# EAGLE design PiGI-V1.1 (EAGLE 6.2)
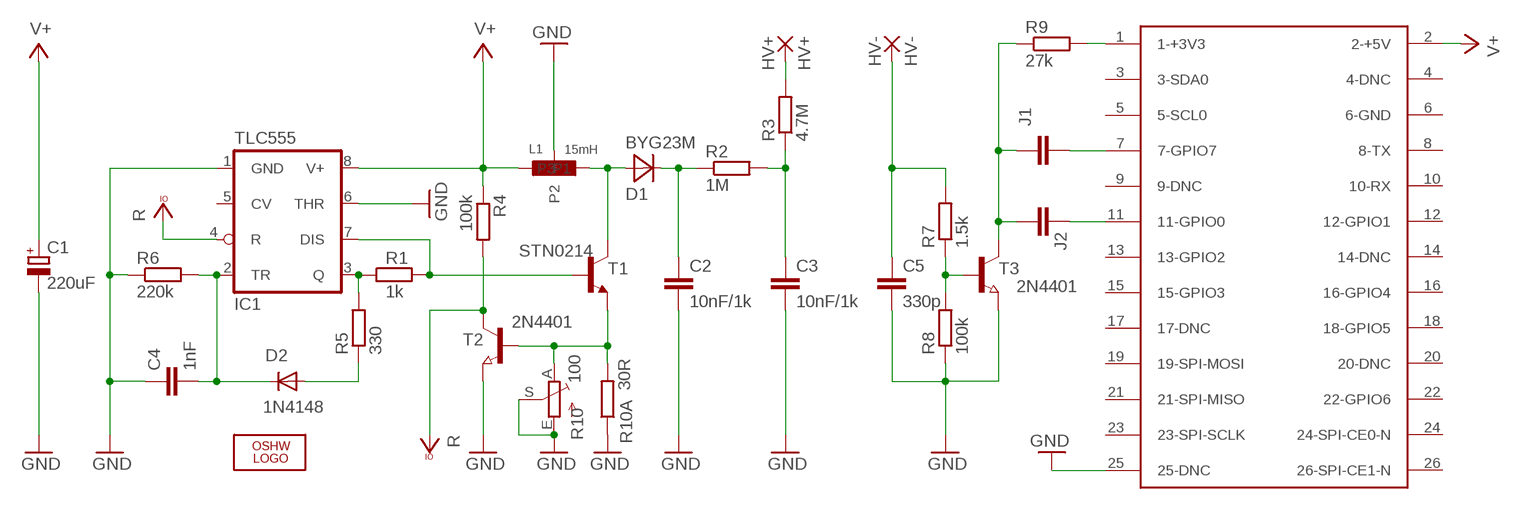
[diagram p0: schematic, sheet 1]

## Parts
C1  220uF  CPOL-EU153CLV-0810  [153CLV-0810]
C2  10nF/1k  C-EUC1206  [C1206]
C3  10nF/1k  C-EUC1206  [C1206]
C4  1nF  C-EUC0805  [C0805]
C5  330p  C-EUC0805  [C0805]
D1  BYG23M  MBRA340T3  [SMA]
D2  1N4148  CGRM4001-G  [SOD-123_MINI-SMA]
HV+  HV+  SMD5  [SMD2,54-5,08]
HV-  HV-  SMD5  [SMD2,54-5,08]
IC1  TLC555  NE555D  [SO08]
J1  C-EUC0805  [C0805]
J2  C-EUC0805  [C0805]
L1  15mH  1200LRS  [1200LRS]
LOGO1  OSHW_LOGO_FILLX0150-NT  [OSHW_FILLX150_NOTEXT]
PI-GIV1.0  RASPBERRY-PI  [RASPBERRY-PI]
R1  1k  R-EU_M0805  [M0805]
R2  1M  R-EU_R1206  [R1206]
R3  4.7M  R-EU_R1206  [R1206]
R4  100k  R-EU_R0805  [R0805]
R5  330  R-EU_R0805  [R0805]
R6  220k  R-EU_R0805  [R0805]
R7  1.5k  R-EU_R0805  [R0805]
R8  100k  R-EU_R0805  [R0805]
R9  27k  R-EU_R0805  [R0805]
R10  100  TRIM_EU-RJ9W  [RJ9W]
R10A  30R  R-EU_M0805  [M0805]
T1  STN0214  -NPN-SOT223  [SOT223]
T2  2N4401  NPN-TRANSISTOR_SOT23  [SOT23]
T3  2N4401  NPN-TRANSISTOR_SOT23  [SOT23]

## Nets
DIS: IC1.7(DIS) R1.2 T1.1(B)
GND: C1.- C2.2 C3.2 C4.1 C5.2 IC1.1(GND) IC1.6(THR) L1.P4(P2) PI-GIV1.0.25(25-DNC) R6.1 R8.1 R10.E(A) R10.S R10A.1 T2.2(E) T3.2(E)
N$1: IC1.3(Q) R1.1 R5.2
N$2: D2.A R5.1
N$3: C2.1 D1.C R2.1
N$4: PI-GIV1.0.1(1-+3V3) R9.2
N$5: C4.2 D2.C IC1.2(TR) R6.2
N$6: D1.A L1.P3 T1.4(C)
N$7: R10.A(E) R10A.2 T1.3(E) T2.1(B)
N$8: C3.1 R2.2 R3.1
N$9: R7.1 R8.2 T3.1(B)
N$10: J1.2 J2.2 R9.1 T3.3(C)
N$11: C5.1 HV-.1(P) R7.2
N$12: HV+.1(P) R3.2
N$13: J1.1 PI-GIV1.0.7(7-GPIO7)
N$14: J2.1 PI-GIV1.0.11(11-GPIO0)
V+: C1.+ IC1.8(V+) L1.P1 PI-GIV1.0.2(2-+5V) R4.1
VCCIO: IC1.4(R) R4.2 T2.3(C) ; supply symbol labelled R
Unconnected: IC1.5(CV) PI-GIV1.0.3(3-SDA0) PI-GIV1.0.4(4-DNC) PI-GIV1.0.5(5-SCL0) PI-GIV1.0.6(6-GND) PI-GIV1.0.8(8-TX) PI-GIV1.0.9(9-DNC) PI-GIV1.0.10(10-RX) PI-GIV1.0.12(12-GPIO1) PI-GIV1.0.13(13-GPIO2) PI-GIV1.0.14(14-DNC) PI-GIV1.0.15(15-GPIO3) PI-GIV1.0.16(16-GPIO4) PI-GIV1.0.17(17-DNC) PI-GIV1.0.18(18-GPIO5) PI-GIV1.0.19(19-SPI-MOSI) PI-GIV1.0.20(20-DNC) PI-GIV1.0.21(21-SPI-MISO) PI-GIV1.0.22(22-GPIO6) PI-GIV1.0.23(23-SPI-SCLK) PI-GIV1.0.24(24-SPI-CE0-N) PI-GIV1.0.26(26-SPI-CE1-N)

## Library data of the parts
C1 = rcl:CPOL-EU: POLARIZED CAPACITOR, European symbol
C2-C5 J1 J2 = rcl:C-EU: CAPACITOR, European symbol
D1 = diode:MBRA340T3: Surface Mount Schottky Power Rectifier Source: http://www.onsemi.com/pub_link/Collateral/MBRA340T3-D.PDF
D2 = diode:CGRM400*-G: Molded plasitc,JEDEC SOD-123/Mini SMA Source: Comchip CGRM4001-G.pdf
HV+ HV- = wirepad:SMD5: SMD PAD
IC1 = linear:*555: TIMER
L1 = murata-inductors:1200LRS
LOGO1 = ohw-logo:OSHW_LOGO_FILL
PI-GIV1.0 = RaspberryPi:RASPBERRY-PI: Raspberry Pi Board <http://www.raspberrypi.org/> Jacques Lagnel V1.0 (beta) 2012 Board dimension: Forum 3D model <http://www.raspberrypi.org/forum/general-discussion/mechanical-profile-3d-models?value=3d%20model&type=1&include=1&search=1&ret=all> The GPIO Connector (P1): http://elinux.org/RPi_Low-level_peripherals
R1-R9 R10A = resistor:R-EU_: RESISTOR, European symbol
R10 = pot:TRIM_EU-: POTENTIOMETER
T1 = transistor-neu-to92:*-NPN-: NPN Transistror
T2 T3 = semicon-smd-ipc:NPN-TRANSISTOR_: NPN TRANSISTOR

## Board
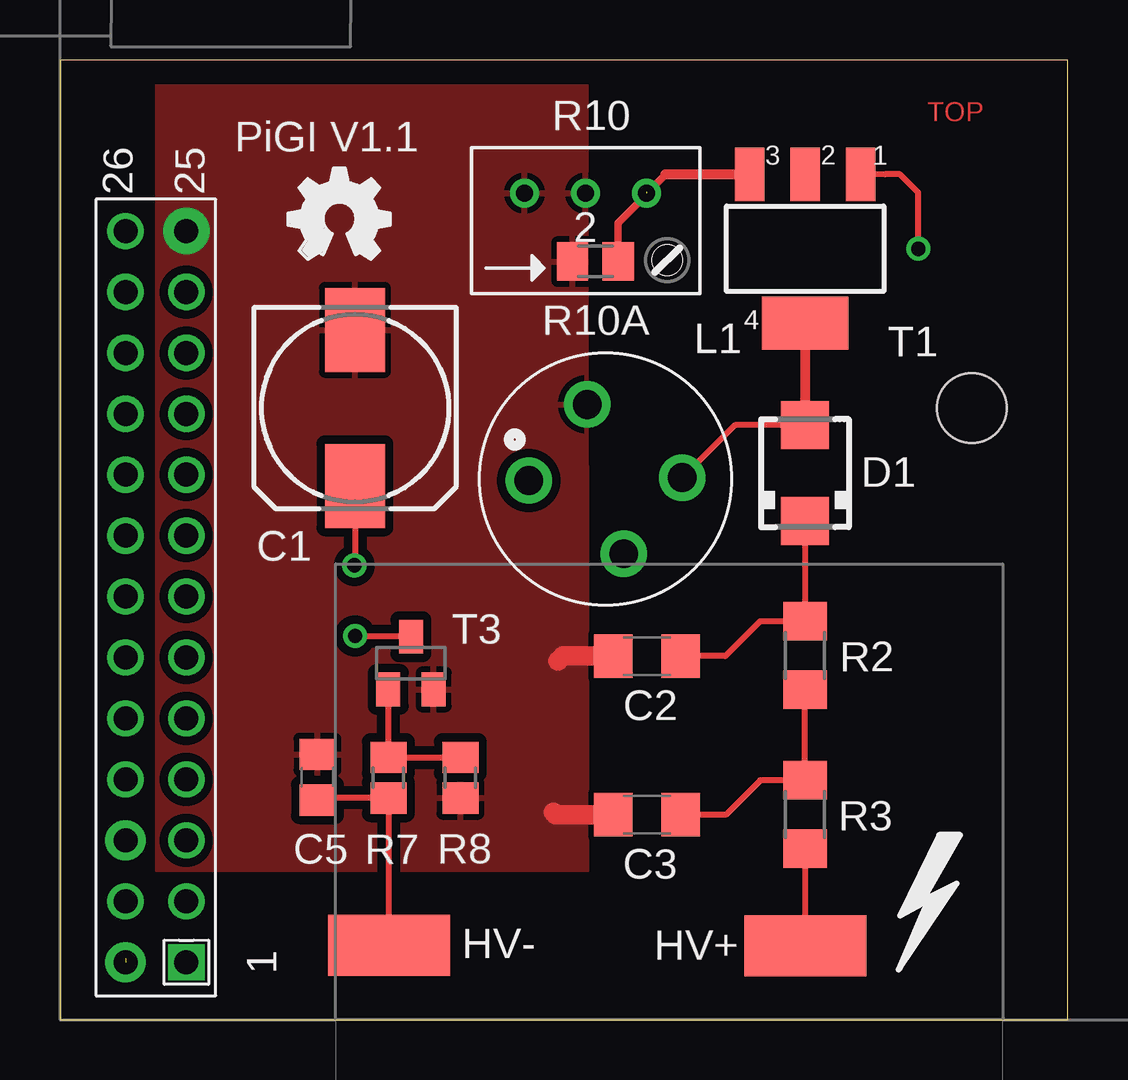
[diagram p1: board, top side]
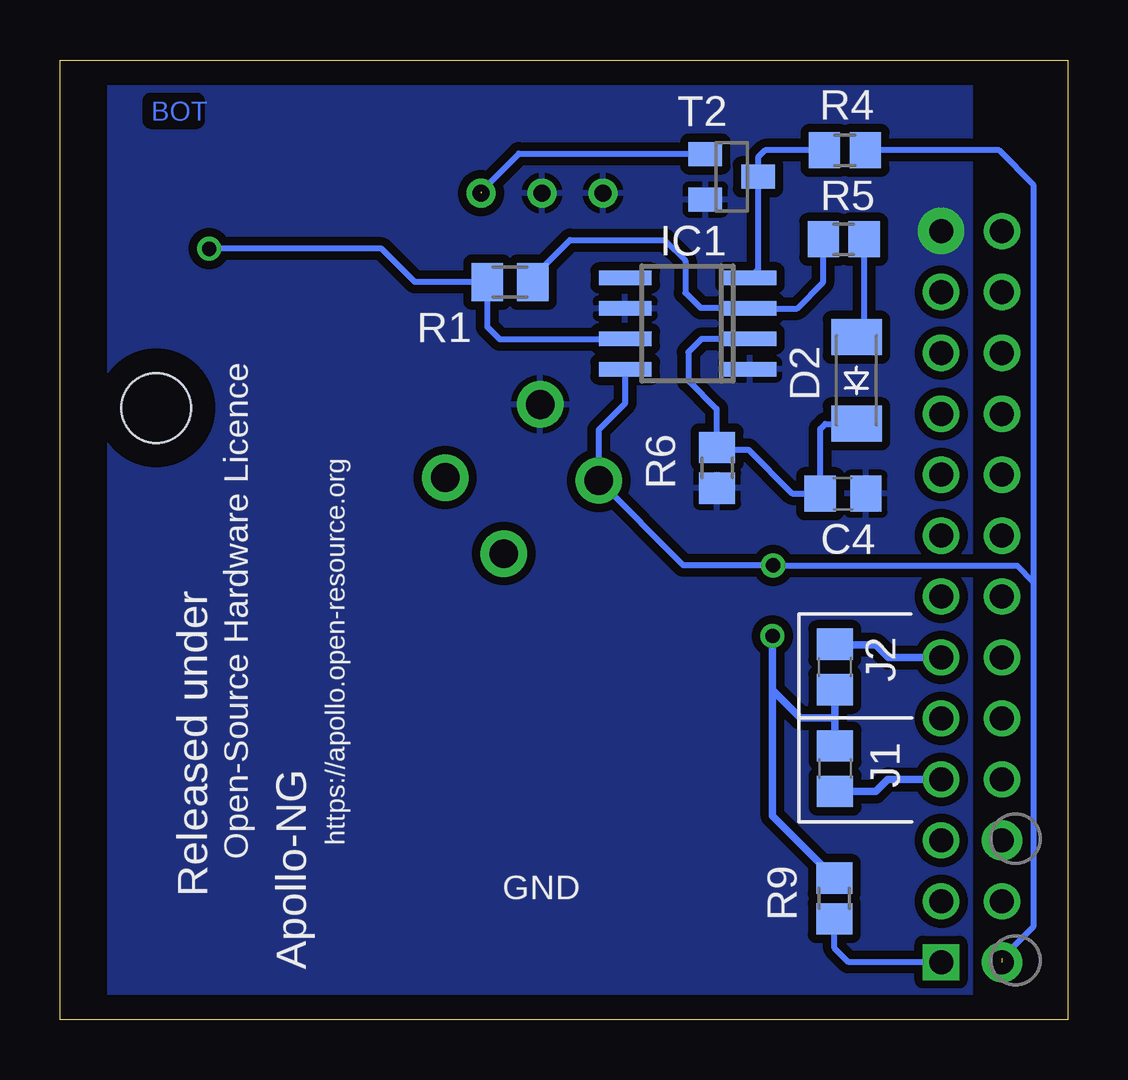
[diagram p2: board, bottom side, seen from below]

Size 42 x 40 mm. Coordinates in mm from the lower left corner, seen from the top.
Outline: 0,0 42,0 42,40 0,40 0,0
Copper layers (1*16): Top 0.035mm / dielectric 1.5mm / Bottom 0.035mm
Design rules: minimum track width 10mil, minimum drill 24mil, track to track 8mil, track to pad 8mil, pad to pad 8mil, via to via 8mil, smd to smd 8mil, copper to edge 40mil, drill to drill 8mil, minimum pad ring 10mil, minimum via ring 8mil, stop-mask expansion 4mil, vias tented up to drill 0mil, thermal gap 10mil
Holes 2.9 mm at 38,25.5

### Footprints (pad centres in the part's own frame; a part is rotated, then mirrored left to right if it is on the bottom)
153CLV-0810 = smd 3.5 x 2.5: + 3.25,0; - -3.25,0
C1206 = smd 1.6 x 1.8: 1 -1.4,0; 2 1.4,0
C0805 = smd 1.3 x 1.5: 1 -0.95,0; 2 0.95,0
SMA = smd 2 x 2: A 2,0; C -2,0
SOD-123_MINI-SMA = smd 1.5 x 2.1: A 1.8,0; C -1.8,0
SMD2,54-5,08 = smd 2.54 x 5.08: 1 0,0
SO08 = smd 0.6 x 2.2: 1 -1.905,-2.6; 2 -0.635,-2.6; 3 0.635,-2.6; 4 1.905,-2.6; 5 1.905,2.6; 6 0.635,2.6; 7 -0.635,2.6; 8 -1.905,2.6
1200LRS = drill 1.2 pad 1.93: P1 -2,2.5; P2 -2,-2.5; P3 2,-2.5; P4 2,2.5
RASPBERRY-PI = drill 1 square: 1 0,0 | drill 1 pad 1.676: 2 0,2.54; 6 5.08,2.54 | drill 1: 3 2.54,0; 4 2.54,2.54; 5 5.08,0; 7 7.62,0; 8 7.62,2.54; 9 10.16,0; 10 10.16,2.54; 11 12.7,0; 12 12.7,2.54; 13 15.24,0; 14 15.24,2.54; 15 17.78,0; 16 17.78,2.54; 17 20.32,0; 18 20.32,2.54; 19 22.86,0; 20 22.86,2.54; 21 25.4,0; 22 25.4,2.54; 23 27.94,0; 24 27.94,2.54; 26 30.48,2.54 | drill 1 pad 1.93: 25 30.48,0
M0805 = smd 1.3 x 1.6: 1 -0.95,0; 2 0.95,0
R1206 = smd 1.6 x 1.803: 1 -1.422,0; 2 1.422,0
R0805 = smd 1.3 x 1.5: 1 -0.85,0; 2 0.85,0
RJ9W = drill 0.7: A 2.54,1.143; E -2.54,1.143; S 0,1.143
SOT223 = smd 1.219 x 2.235: 1 -2.311,-3.099; 2 0,-3.099; 3 2.311,-3.099 | smd 3.6 x 2.2: 4 0,3.099
SOT23 = smd 1 x 1.4: 1 -0.95,-1.1; 2 0.95,-1.1; 3 0,1.1

### Placement (x,y rotation side)
C1  12.3,25.49 270 top
C2  24.47,15.15 180 top
C3  24.47,8.54 180 top
C4  9.36,21.92 180 bottom
C5  10.73,10.1 90 top
D1  31.06,22.78 90 top
D2  8.8,26.64 90 bottom
HV+  31.07,3.07 270 top
HV-  13.71,3.09 90 top
IC1  15.84,29.01 90 bottom
J1  9.69,10.46 90 bottom
J2  9.7,14.7 270 bottom
L1  22.74,22.53 52.4 top
LOGO1  9.52,31.69 0 top
PI-GIV1.0  5.27,2.39 90 top
R1  23.24,30.74 180 bottom
R2  31.06,15.18 270 top
R3  31.06,8.55 270 top
R4  9.28,36.23 180 bottom
R5  9.33,32.53 180 bottom
R6  14.61,23 90 bottom
R7  13.69,10.08 270 top
R8  16.69,10.08 90 top
R9  9.72,5.05 270 bottom
R10  21.91,33.3 0 top
R10A  22.32,31.6 0 top
T1  31.06,32.13 180 top
T2  14,35.13 270 bottom
T3  14.63,14.86 0 top

### Tracks (layer width: path | path; a pad name or v marks a point on that pad's centre or on a via)
DIS  (via drill 0.6)
  Top 0.254: v35.78,32.13 35.78,34.47 35.02,35.23 34.39,35.23 T1.1
  Bottom 0.254: IC1.7 18.45,28.36 23.67,28.36 24.19,28.88 R1.2 27.2,30.74 28.59,32.13 v35.78,32.13
GND
  Top 0.813: C2.2 20.96,15.15 20.76,14.95 | C3.2 20.68,8.54 20.58,8.64
  pour Bottom (isolate 0.35): 4,40 40,40 40,0 4,0
  pour Top (isolate 0.35): 4,40 21.98,40.01 22,6.2 4,6.2
N$1
  Bottom 0.254: 13.27,29.67 15.3,29.67 15.93,30.3 15.93,31.63 16.8,32.5 20.73,32.5 22.29,30.94 | IC1.3 11.27,29.64 10.2,30.71 10.2,32.81 R5.2
  Bottom 0.406: R1.1 22.29,30.94 | 13.27,29.67 IC1.3
N$2
  Bottom 0.254: 8.48,28.75 D2.A 8.48,28.76 R5.1
N$3
  Top 0.254: D1.C R2.1 29.18,16.6 27.73,15.15 C2.1
N$4
  Bottom 0.254: PI-GIV1.0.1 9.13,2.39 9.71,2.97 R9.2
N$5
  Bottom 0.254: IC1.2 15.26,28.38 15.81,27.82 15.81,26.63 14.63,25.45 14.63,23.87 R6.2 14.52,23.76 13.31,23.76 11.48,21.93 C4.2 10.31,24.62 10.1,24.83 D2.C
N$6
  Top 0.254: D1.A 28.13,24.78 L1.P3
  Top 0.406: T1.4 D1.A
N$7  (1 unrouted)
  Top 0.305: 25.24,35.23 R10.A 24.45,34.38 23.27,33.2 R10A.2
  Top 0.406: T1.3 25.24,35.23
  Bottom 0.254: 24.45,34.52 22.87,36.1 15.12,36.1 T2.1
N$8
  Top 0.254: R3.1 R2.2 | R3.1 29.19,9.97 27.76,8.54 C3.1 | 31.23,9.8 R3.1
N$9
  Top 0.254: T3.1 R7.1 R8.2
N$10  (via drill 0.6)
  Top 0.254: v12.3,15.99 14.6,15.99 T3.3
  Bottom 0.305: R9.1 12.3,8.48 v12.3,15.99 12.3,13.74 11.14,12.58 9.72,12.58 9.71,12.6 | J2.2 9.71,12.6 | 9.71,12.6 9.71,11.51 J1.2
N$11
  Top 0.254: HV-.1 13.71,9.21 R7.2 10.81,9.23 C5.1
N$12
  Top 0.254: HV+.1 31.07,7.12 R3.2 31.19,7.26
N$13
  Bottom 0.305: J1.1 8,9.51 7.48,10.02 PI-GIV1.0.7
N$14
  Bottom 0.305: PI-GIV1.0.11 7.47,15.09 7.99,15.61 9.66,15.61 J2.1
V+  (via drill 0.6)  (1 unrouted)
  Top 0.254: C1.+ 12.3,19.09 v12.27,18.93 | 12.49,18.9 v12.27,18.93 | 12.24,18.9 v12.27,18.93
  Bottom 0.254: IC1.8 18.43,27.09 18.43,25.7 19.54,24.59 L1.P1 16.02,18.95 16.02,18.93 v12.27,18.93 v12.26,18.92 2.1,18.92 1.43,18.25 | 1.43,18.25 1.43,34.81 2.85,36.23 R4.1 | 1.43,18.25 1.43,3.86 2.73,2.56
VCCIO
  Bottom 0.254: R4.2 12.61,36.23 12.9,35.94 T2.3 12.9,31.25 IC1.4

### Text on the board
Top: TOP
Bottom: BOT
tNames: PiGI V1.1
bNames: Open-Source Hardware Licence | https://apollo.open-resource.org | Released under | GND | Apollo-NG